# Altium schematic sheet Top_Level.SchDoc
size A
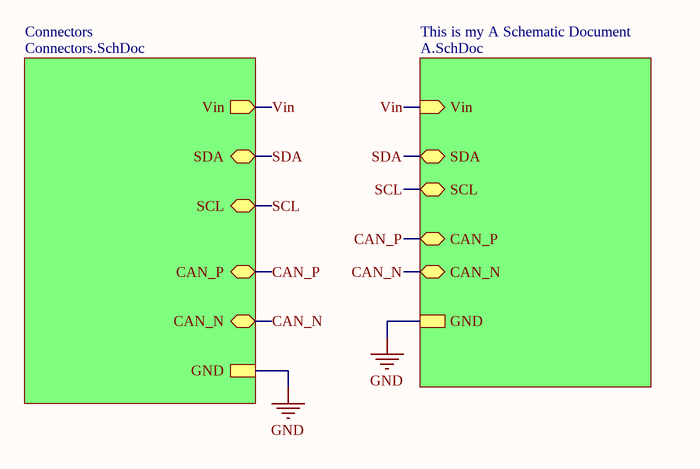
[diagram p0: Top_Level.SchDoc]

## Sub-sheets
Connectors = Connectors.SchDoc: Vin (out), SDA (bidir), SCL (bidir), CAN_P (bidir), CAN_N (bidir), GND
This is my A Schematic Document = A.SchDoc: GND, Vin (in), SDA (bidir), SCL (bidir), CAN_P (bidir), CAN_N (bidir)

## Nets
GND: sheet This is my A Schematic Document/GND, sheet Connectors/GND
CAN_N: sheet This is my A Schematic Document/CAN_N, sheet Connectors/CAN_N
CAN_P: sheet This is my A Schematic Document/CAN_P, sheet Connectors/CAN_P
SCL: sheet This is my A Schematic Document/SCL, sheet Connectors/SCL
SDA: sheet This is my A Schematic Document/SDA, sheet Connectors/SDA
Vin: sheet This is my A Schematic Document/Vin, sheet Connectors/Vin